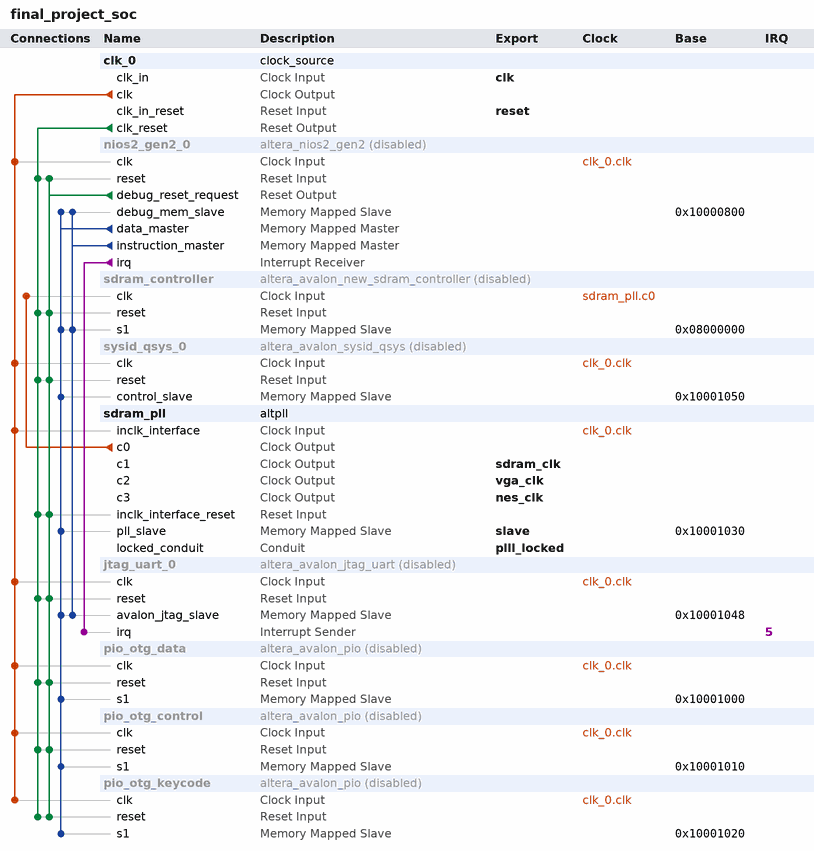
[diagram p0: system contents]
# Platform Designer (Qsys) system final_project_soc, Cyclone IV E EP4CE115F29C7
# Parameters at their usual value, and those the tool derives, are not listed.
package require -exact qsys 18.1
create_system final_project_soc
set_project_property DEVICE_FAMILY {Cyclone IV E}
set_project_property DEVICE EP4CE115F29C7

add_instance clk_0 clock_source 18.1
set_instance_parameter_value clk_0 clockFrequency 50000000

add_instance nios2_gen2_0 altera_nios2_gen2 18.1
set_instance_property nios2_gen2_0 ENABLED false
set_instance_parameter_value nios2_gen2_0 dcache_size 2048
set_instance_parameter_value nios2_gen2_0 exceptionSlave sdram_controller.s1
set_instance_parameter_value nios2_gen2_0 icache_size 4096
set_instance_parameter_value nios2_gen2_0 impl Tiny
set_instance_parameter_value nios2_gen2_0 resetSlave sdram_controller.s1

add_instance sdram_controller altera_avalon_new_sdram_controller 18.1
set_instance_property sdram_controller ENABLED false
set_instance_parameter_value sdram_controller TAC 5.5
set_instance_parameter_value sdram_controller TRCD 20.0
set_instance_parameter_value sdram_controller TRP 20.0
set_instance_parameter_value sdram_controller casLatency 3
set_instance_parameter_value sdram_controller columnWidth 10
set_instance_parameter_value sdram_controller dataWidth 32
set_instance_parameter_value sdram_controller generateSimulationModel false
set_instance_parameter_value sdram_controller model single_Micron_MT48LC4M32B2_7_chip
set_instance_parameter_value sdram_controller numberOfBanks 4
set_instance_parameter_value sdram_controller numberOfChipSelects 1
set_instance_parameter_value sdram_controller powerUpDelay 200.0
set_instance_parameter_value sdram_controller refreshPeriod 7.8125
set_instance_parameter_value sdram_controller rowWidth 13

add_instance sysid_qsys_0 altera_avalon_sysid_qsys 18.1
set_instance_property sysid_qsys_0 ENABLED false
set_instance_parameter_value sysid_qsys_0 id 0

add_instance sdram_pll altpll 18.1
set_instance_parameter_value sdram_pll CLK0_DIVIDE_BY 1
set_instance_parameter_value sdram_pll CLK0_MULTIPLY_BY 1
set_instance_parameter_value sdram_pll CLK1_DIVIDE_BY 1
set_instance_parameter_value sdram_pll CLK1_DUTY_CYCLE 50
set_instance_parameter_value sdram_pll CLK1_MULTIPLY_BY 1
set_instance_parameter_value sdram_pll CLK1_PHASE_SHIFT -3000
set_instance_parameter_value sdram_pll CLK2_DIVIDE_BY 2
set_instance_parameter_value sdram_pll CLK2_DUTY_CYCLE 50
set_instance_parameter_value sdram_pll CLK2_MULTIPLY_BY 1
set_instance_parameter_value sdram_pll CLK2_PHASE_SHIFT 0
set_instance_parameter_value sdram_pll CLK3_DIVIDE_BY 7
set_instance_parameter_value sdram_pll CLK3_DUTY_CYCLE 50
set_instance_parameter_value sdram_pll CLK3_MULTIPLY_BY 3
set_instance_parameter_value sdram_pll CLK3_PHASE_SHIFT 0
set_instance_parameter_value sdram_pll INCLK0_INPUT_FREQUENCY 20000
set_instance_parameter_value sdram_pll PORT_ARESET PORT_UNUSED
set_instance_parameter_value sdram_pll PORT_LOCKED PORT_USED
set_instance_parameter_value sdram_pll PORT_clk1 PORT_USED
set_instance_parameter_value sdram_pll PORT_clk2 PORT_USED
set_instance_parameter_value sdram_pll PORT_clk3 PORT_USED

add_instance jtag_uart_0 altera_avalon_jtag_uart 18.1
set_instance_property jtag_uart_0 ENABLED false
set_instance_parameter_value jtag_uart_0 simInteractiveOptions NO_INTERACTIVE_WINDOWS

add_instance pio_otg_data altera_avalon_pio 18.1
set_instance_property pio_otg_data ENABLED false
set_instance_parameter_value pio_otg_data direction InOut
set_instance_parameter_value pio_otg_data width 16

add_instance pio_otg_control altera_avalon_pio 18.1
set_instance_property pio_otg_control ENABLED false
set_instance_parameter_value pio_otg_control direction Output
set_instance_parameter_value pio_otg_control width 6

add_instance pio_otg_keycode altera_avalon_pio 18.1
set_instance_property pio_otg_keycode ENABLED false
set_instance_parameter_value pio_otg_keycode direction Output
set_instance_parameter_value pio_otg_keycode width 32

# connections
add_connection clk_0.clk jtag_uart_0.clk clock
add_connection clk_0.clk nios2_gen2_0.clk clock
add_connection clk_0.clk pio_otg_control.clk clock
add_connection clk_0.clk pio_otg_data.clk clock
add_connection clk_0.clk pio_otg_keycode.clk clock
add_connection clk_0.clk sdram_pll.inclk_interface clock
add_connection clk_0.clk sysid_qsys_0.clk clock
add_connection sdram_pll.c0 sdram_controller.clk clock
add_connection clk_0.clk_reset jtag_uart_0.reset reset
add_connection clk_0.clk_reset nios2_gen2_0.reset reset
add_connection clk_0.clk_reset pio_otg_control.reset reset
add_connection clk_0.clk_reset pio_otg_data.reset reset
add_connection clk_0.clk_reset pio_otg_keycode.reset reset
add_connection clk_0.clk_reset sdram_controller.reset reset
add_connection clk_0.clk_reset sdram_pll.inclk_interface_reset reset
add_connection clk_0.clk_reset sysid_qsys_0.reset reset
add_connection nios2_gen2_0.debug_reset_request jtag_uart_0.reset reset
add_connection nios2_gen2_0.debug_reset_request nios2_gen2_0.reset reset
add_connection nios2_gen2_0.debug_reset_request pio_otg_control.reset reset
add_connection nios2_gen2_0.debug_reset_request pio_otg_data.reset reset
add_connection nios2_gen2_0.debug_reset_request pio_otg_keycode.reset reset
add_connection nios2_gen2_0.debug_reset_request sdram_controller.reset reset
add_connection nios2_gen2_0.debug_reset_request sdram_pll.inclk_interface_reset reset
add_connection nios2_gen2_0.debug_reset_request sysid_qsys_0.reset reset
add_connection nios2_gen2_0.data_master jtag_uart_0.avalon_jtag_slave avalon
set_connection_parameter_value nios2_gen2_0.data_master/jtag_uart_0.avalon_jtag_slave baseAddress 0x10001048
add_connection nios2_gen2_0.data_master nios2_gen2_0.debug_mem_slave avalon
set_connection_parameter_value nios2_gen2_0.data_master/nios2_gen2_0.debug_mem_slave baseAddress 0x10000800
add_connection nios2_gen2_0.data_master pio_otg_control.s1 avalon
set_connection_parameter_value nios2_gen2_0.data_master/pio_otg_control.s1 baseAddress 0x10001010
add_connection nios2_gen2_0.data_master pio_otg_data.s1 avalon
set_connection_parameter_value nios2_gen2_0.data_master/pio_otg_data.s1 baseAddress 0x10001000
add_connection nios2_gen2_0.data_master pio_otg_keycode.s1 avalon
set_connection_parameter_value nios2_gen2_0.data_master/pio_otg_keycode.s1 baseAddress 0x10001020
add_connection nios2_gen2_0.data_master sdram_controller.s1 avalon
set_connection_parameter_value nios2_gen2_0.data_master/sdram_controller.s1 baseAddress 0x08000000
add_connection nios2_gen2_0.data_master sdram_pll.pll_slave avalon
set_connection_parameter_value nios2_gen2_0.data_master/sdram_pll.pll_slave baseAddress 0x10001030
add_connection nios2_gen2_0.data_master sysid_qsys_0.control_slave avalon
set_connection_parameter_value nios2_gen2_0.data_master/sysid_qsys_0.control_slave baseAddress 0x10001050
add_connection nios2_gen2_0.instruction_master jtag_uart_0.avalon_jtag_slave avalon
set_connection_parameter_value nios2_gen2_0.instruction_master/jtag_uart_0.avalon_jtag_slave baseAddress 0x10001048
add_connection nios2_gen2_0.instruction_master nios2_gen2_0.debug_mem_slave avalon
set_connection_parameter_value nios2_gen2_0.instruction_master/nios2_gen2_0.debug_mem_slave baseAddress 0x10000800
add_connection nios2_gen2_0.instruction_master sdram_controller.s1 avalon
set_connection_parameter_value nios2_gen2_0.instruction_master/sdram_controller.s1 baseAddress 0x08000000
add_connection nios2_gen2_0.irq jtag_uart_0.irq interrupt
set_connection_parameter_value nios2_gen2_0.irq/jtag_uart_0.irq irqNumber 5

# exported interfaces
add_interface clk clock sink
set_interface_property clk EXPORT_OF clk_0.clk_in
add_interface nes_clk clock source
set_interface_property nes_clk EXPORT_OF sdram_pll.c3
add_interface plll_locked conduit end
set_interface_property plll_locked EXPORT_OF sdram_pll.locked_conduit
add_interface reset reset sink
set_interface_property reset EXPORT_OF clk_0.clk_in_reset
add_interface sdram_clk clock source
set_interface_property sdram_clk EXPORT_OF sdram_pll.c1
add_interface slave avalon slave
set_interface_property slave EXPORT_OF sdram_pll.pll_slave
add_interface vga_clk clock source
set_interface_property vga_clk EXPORT_OF sdram_pll.c2

set_interconnect_requirement {$system} qsys_mm.clockCrossingAdapter HANDSHAKE
set_interconnect_requirement {$system} qsys_mm.enableEccProtection FALSE
set_interconnect_requirement {$system} qsys_mm.insertDefaultSlave FALSE
set_interconnect_requirement {$system} qsys_mm.maxAdditionalLatency 1

save_system final_project_soc.qsys
